# Altium schematic sheet main.SchDoc
size A
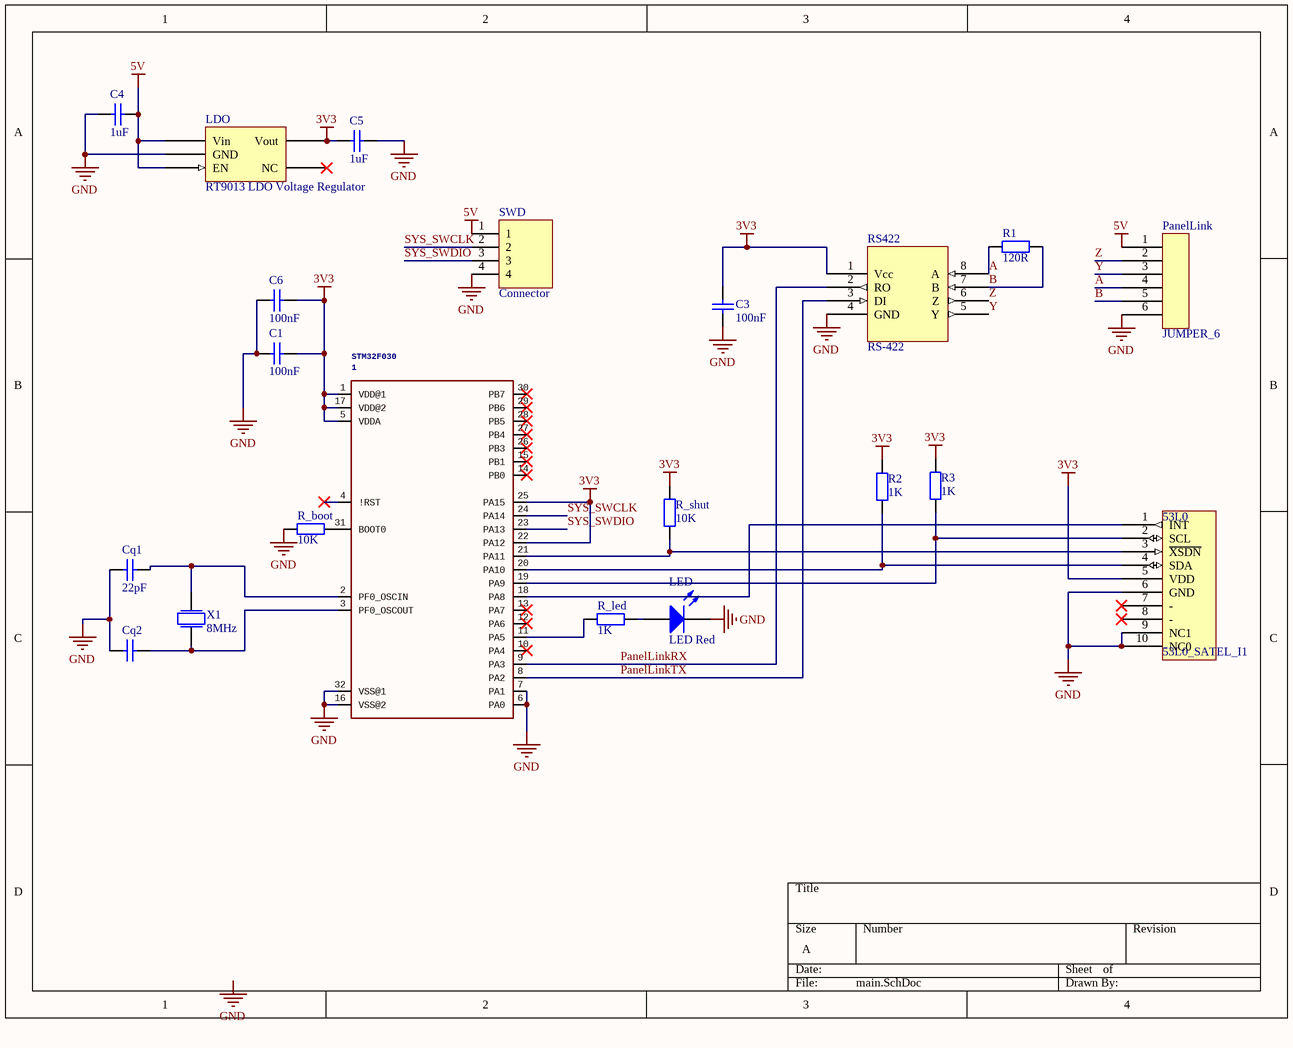
[diagram p0: main.SchDoc]

## Parts
1  STM32F030  [TQFP32-08]
53L0  53L0_SATEL_I1  [53L1X-SATEL-I1]
C1  100nF  [FP_0805_CAP_085]
C3  100nF  [FP_0805_CAP_085]
C4  1uF  [FP_0805_CAP_085]
C5  1uF  [FP_0805_CAP_085]
C6  100nF  [FP_0805_CAP_085]
Cq1  22pF  [FP_0805_CAP_085]
Cq2  (no value)  [FP_0805_CAP_085]
LDO  RT9013 LDO Voltage Regulator  [RT9013_SOT23]
LED  LED Red  [FP_0805_LED_RED]
PanelLink  JUMPER_6  [JUMPER_6]
R1  120R  [FP_0805_RES]
R2  1K  [FP_0805_RES]
R3  1K  [FP_0805_RES]
R_boot  10K  [FP_0805_RES]
R_led  1K  [FP_0805_RES]
R_shut  10K  [FP_0805_RES]
RS422  RS-422  [NSOIC-8]
SWD  Connector  [FP_CONN4_TUSKE_254MM]
X1  8MHz  [FP_CRYSTAL_HC49_SMD]

## Nets
3V3: 1.1(VDD@1) 1.5(VDDA) 1.17(VDD@2) 1.22(PA12) 1.25(PA15) 53L0.5(VDD) C1.2 C3.2 C5.1 C6.2 LDO.Vout R2.2 R3.2 R_shut.2 RS422.1(Vcc)
5V: C4.2 LDO.EN LDO.Vin PanelLink.1 SWD.1
GND: 1.6(PA0) 1.7(PA1) 1.16(VSS@2) 1.32(VSS@1) 53L0.6(GND) 53L0.9(NC1) 53L0.10(NC0) C1.1 C3.1 C4.1 C5.2 C6.1 Cq1.1 Cq2.1 LDO.GND LED.2(K) PanelLink.6 R_boot.1 RS422.4(GND) SWD.4
A: PanelLink.4 R1.1 RS422.8(A)
B: PanelLink.5 R1.2 RS422.7(B)
PanelLinkRX: 1.9(PA3) RS422.2(RO)
PanelLinkTX: 1.8(PA2) RS422.3(DI)
SYS_SWCLK: 1.24(PA14) SWD.2
SYS_SWDIO: 1.23(PA13) SWD.3
Y: PanelLink.3 RS422.5(Y)
Z: PanelLink.2 RS422.6(Z)
Net1_2: 1.2(PF0_OSCIN) Cq1.2 X1.2
Net1_3: 1.3(PF0_OSCOUT) Cq2.2 X1.1
Net1_11: 1.11(PA5) R_led.2
Net1_18: 1.18(PA8) 53L0.1(INT)
Net1_19: 1.19(PA9) 53L0.2(SCL) R3.1
Net1_20: 1.20(PA10) 53L0.4(SDA) R2.1
Net1_21: 1.21(PA11) 53L0.3(~{XSDN}) R_shut.1
Net1_31: 1.31(BOOT0) R_boot.2
NetLED_1: LED.1(A) R_led.1

Not connected (* = marked no-connect by the designer): 1 4(!RST)* 10(PA4)* 12(PA6)* 13(PA7)* 14(PB0)* 15(PB1)* 26(PB3)* 27(PB4)* 28(PB5)* 29(PB6)* 30(PB7)*; 53L0 7(-)* 8(-)*; LDO NC*

## Notes on the sheet
- Labels drawn without touching a wire or pin: GND

## Library data of the parts
1 = STM32F030: GateName_1: G$1; SymbolName_1: STM32F030X; LibraryName: stm32F030x; DeviceSetName: STM32F030; Package: TQFP32-08
C1 C3 C6 = CAP 100nF: Capacitor; Tolerance: +80%/-20%; Voltage: 25V; Reference: 1759167; Name: SMD Multilayer Ceramic Capacitor, 0805; Supplier: Farnell; Value: 100nF
C4 C5 = CAP 1uF: Capacitor; Tolerance: +80%/-20%; Voltage: 25V; Reference: 1828853; Name: SMD Multilayer Ceramic Capacitor, 0805; Supplier: Farnell; Value: 1uF
Cq1 Cq2 = CAP 22pF: Capacitor; Tolerance: 5%; Voltage: 50V; Reference: 1759195; Name: SMD Multilayer Ceramic Capacitor, 0805; Supplier: Farnell
  Cq1: Value: 22pF
LDO = RT9013: LDO Voltage Regulator
LED = LED Red: Red LED; pin to pad: 1>A 2>K; U_fw: 1.85V; I_max: 20mA; Reference: 1581239; Name: MULTICOMP  MCL-S270SRC  LED, Red, SMD, 1.25mm x 1.4mm, 20 mA, 1.85 V, 643 nm; Wavelength: 643nm; Supplier: Farnell
R1 = RES 120R: Resistor; Tolerance: 5%; Power: 125mW; Name: YAGEO (PHYCOMP)  RC0805JR-07120RL  SMD Chip Resistor, Thick Film, 120 ohm; Reference: 9233890; Supplier: Farnell; Value: 120R
R2 R3 R_led = RES 1K: Resistor; Tolerance: 5%; Power: 125mW; Name: YAGEO (PHYCOMP)  RC0805JR-071KL  SMD Chip Resistor, Thick Film, 1 kohm; Reference: 9234004; Supplier: Farnell; Value: 1K
R_boot R_shut = RES 10K: Resistor; Tolerance: 5%; Power: 125mW; Name: YAGEO (PHYCOMP)  RC0805JR-0710KL  SMD Chip Resistor, Thick Film, 10 kohm; Reference: 9234136; Supplier: Farnell; Value: 10K
RS422 = ISL83071: RS-422 transceiver 3V3
SWD = Connector_4pin: 4pin Connector
X1 = Crystal: Quarz Crystal; Value: 8MHz